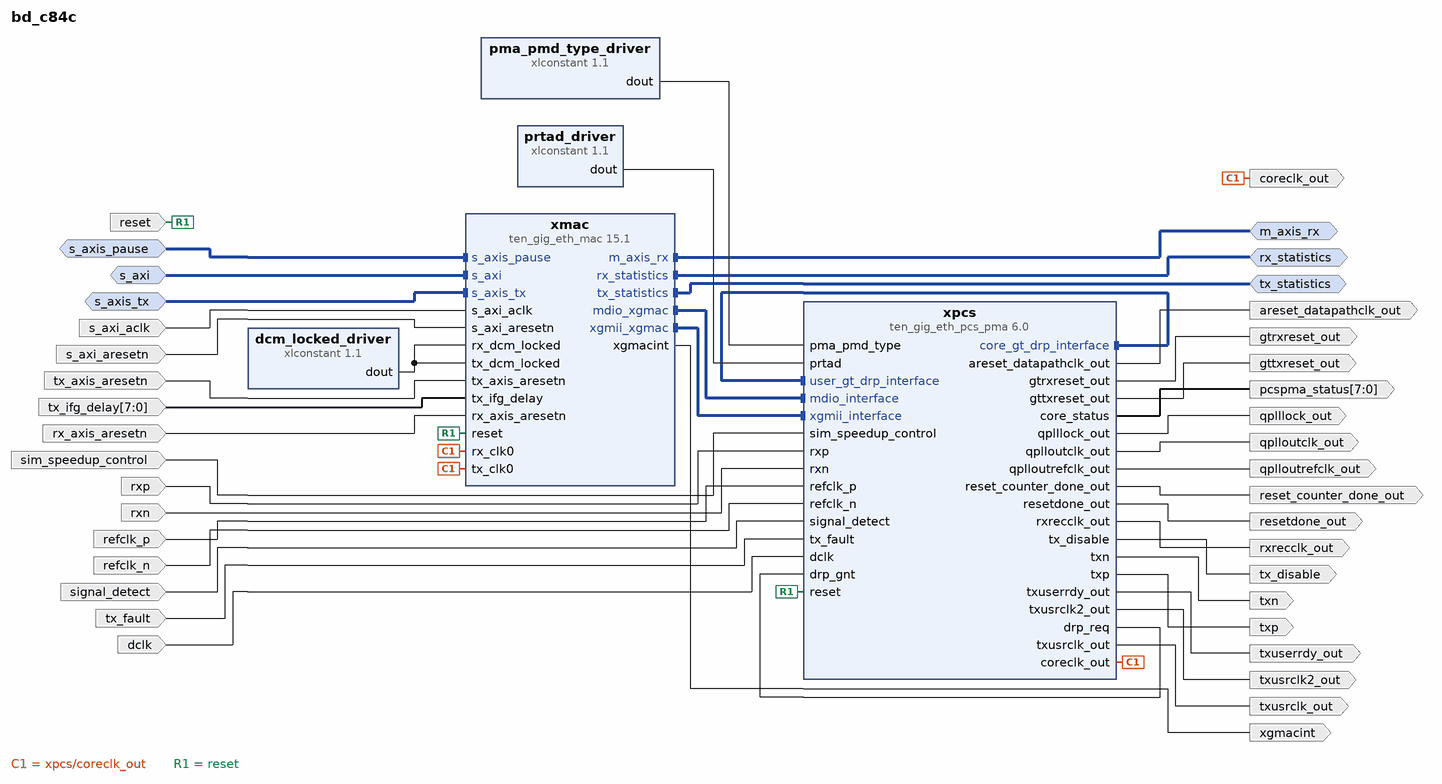
[diagram p0: block diagram of the top level]
# Vivado block design bd_c84c, xc7k325tffg676-2, Vivado 2018.3
create_bd_design bd_c84c

create_bd_intf_port -mode Slave -vlnv xilinx.com:interface:axis_rtl:1.0 s_axis_tx
set_property -dict {CONFIG.FREQ_HZ 156250000} [get_bd_intf_ports s_axis_tx]
create_bd_intf_port -mode Master -vlnv xilinx.com:interface:axis_rtl:1.0 m_axis_rx
set_property -dict {CONFIG.FREQ_HZ 156250000} [get_bd_intf_ports m_axis_rx]
create_bd_intf_port -mode Slave -vlnv xilinx.com:interface:axis_rtl:1.0 s_axis_pause
set_property -dict {CONFIG.FREQ_HZ 156250000} [get_bd_intf_ports s_axis_pause]
create_bd_intf_port -mode Master -vlnv xilinx.com:display_ten_gig_eth_mac:statistics_rtl:2.0 tx_statistics
create_bd_intf_port -mode Master -vlnv xilinx.com:display_ten_gig_eth_mac:statistics_rtl:2.0 rx_statistics
create_bd_intf_port -mode Slave -vlnv xilinx.com:interface:aximm_rtl:1.0 s_axi
set_property -dict {CONFIG.ADDR_WIDTH 16} [get_bd_intf_ports s_axi]
create_bd_port -dir I -type rst tx_axis_aresetn
create_bd_port -dir I -type rst rx_axis_aresetn
create_bd_port -dir I -from 7 -to 0 tx_ifg_delay
create_bd_port -dir I -type clk dclk
create_bd_port -dir O txp
create_bd_port -dir O txn
create_bd_port -dir I rxp
create_bd_port -dir I rxn
create_bd_port -dir I signal_detect
create_bd_port -dir I tx_fault
create_bd_port -dir O tx_disable
create_bd_port -dir O -from 7 -to 0 pcspma_status
create_bd_port -dir I sim_speedup_control
create_bd_port -dir O -type clk rxrecclk_out
set_property -dict {CONFIG.FREQ_HZ 322265625} [get_bd_ports rxrecclk_out]
create_bd_port -dir I -type clk s_axi_aclk
create_bd_port -dir I -type rst s_axi_aresetn
create_bd_port -dir O -type intr xgmacint
create_bd_port -dir O -type rst areset_datapathclk_out
create_bd_port -dir O -type clk txusrclk_out
set_property -dict {CONFIG.FREQ_HZ 322265625} [get_bd_ports txusrclk_out]
create_bd_port -dir O -type clk txusrclk2_out
set_property -dict {CONFIG.FREQ_HZ 322265625} [get_bd_ports txusrclk2_out]
create_bd_port -dir O -type rst gttxreset_out
create_bd_port -dir O -type rst gtrxreset_out
create_bd_port -dir O txuserrdy_out
create_bd_port -dir O -type clk coreclk_out
set_property -dict [list \
  CONFIG.ASSOCIATED_ASYNC_RESET tx_axis_aresetn:rx_axis_aresetn \
  CONFIG.ASSOCIATED_BUSIF m_axis_rx:s_axis_pause:s_axis_tx \
  CONFIG.FREQ_HZ 156250000 \
] [get_bd_ports coreclk_out]
create_bd_port -dir O resetdone_out
create_bd_port -dir O reset_counter_done_out
create_bd_port -dir O qplllock_out
create_bd_port -dir O -type clk qplloutclk_out
create_bd_port -dir O -type clk qplloutrefclk_out
set_property -dict {CONFIG.FREQ_HZ 156250000} [get_bd_ports qplloutrefclk_out]
create_bd_port -dir I refclk_p
set_property -dict {CONFIG.FREQ_HZ 156250000} [get_bd_ports refclk_p]
create_bd_port -dir I refclk_n
set_property -dict {CONFIG.FREQ_HZ 156250000} [get_bd_ports refclk_n]
create_bd_port -dir I -type rst reset

create_bd_cell -type ip -vlnv xilinx.com:ip:ten_gig_eth_mac:15.1 xmac
set_property -dict [list \
  CONFIG.Data_Rate 10Gbps \
  CONFIG.Enable_Priority_Flow_Control false \
  CONFIG.IEEE_1588 None \
  CONFIG.Low_Latency_32_bit_MAC 64bit \
  CONFIG.Management_Frequency 125.00 \
  CONFIG.Management_Interface true \
  CONFIG.Physical_Interface Internal \
  CONFIG.Statistics_Gathering true \
  CONFIG.Timer_Format Time_of_day \
] [get_bd_cells xmac]
create_bd_cell -type ip -vlnv xilinx.com:ip:ten_gig_eth_pcs_pma:6.0 xpcs
set_property -dict [list \
  CONFIG.DClkRate 125.00 \
  CONFIG.IEEE_1588 None \
  CONFIG.Locations X0Y0 \
  CONFIG.MDIO_Management true \
  CONFIG.RefClk clk0 \
  CONFIG.RefClkRate 156.25 \
  CONFIG.SupportLevel 1 \
  CONFIG.Timer_Format Time_of_day \
  CONFIG.TransceiverControl false \
  CONFIG.TransceiverInExample false \
  CONFIG.baser32 64bit \
] [get_bd_cells xpcs]
create_bd_cell -type ip -vlnv xilinx.com:ip:xlconstant:1.1 prtad_driver
set_property -dict {CONFIG.CONST_VAL 0 CONFIG.CONST_WIDTH 5} [get_bd_cells prtad_driver]
create_bd_cell -type ip -vlnv xilinx.com:ip:xlconstant:1.1 dcm_locked_driver
set_property -dict {CONFIG.CONST_VAL 1 CONFIG.CONST_WIDTH 1} [get_bd_cells dcm_locked_driver]
create_bd_cell -type ip -vlnv xilinx.com:ip:xlconstant:1.1 pma_pmd_type_driver
set_property -dict {CONFIG.CONST_VAL 5 CONFIG.CONST_WIDTH 3} [get_bd_cells pma_pmd_type_driver]

# ---- connections ----

connect_bd_intf_net [get_bd_intf_pins xmac/mdio_xgmac] [get_bd_intf_pins xpcs/mdio_interface]
connect_bd_intf_net [get_bd_intf_pins xpcs/core_gt_drp_interface] [get_bd_intf_pins xpcs/user_gt_drp_interface]
connect_bd_intf_net [get_bd_intf_ports s_axis_pause] [get_bd_intf_pins xmac/s_axis_pause]
connect_bd_intf_net [get_bd_intf_pins xmac/xgmii_xgmac] [get_bd_intf_pins xpcs/xgmii_interface]
connect_bd_intf_net [get_bd_intf_ports tx_statistics] [get_bd_intf_pins xmac/tx_statistics]
connect_bd_intf_net [get_bd_intf_ports m_axis_rx] [get_bd_intf_pins xmac/m_axis_rx]
connect_bd_intf_net [get_bd_intf_ports rx_statistics] [get_bd_intf_pins xmac/rx_statistics]
connect_bd_intf_net [get_bd_intf_ports s_axi] [get_bd_intf_pins xmac/s_axi]
connect_bd_intf_net [get_bd_intf_ports s_axis_tx] [get_bd_intf_pins xmac/s_axis_tx]
connect_bd_net [get_bd_ports s_axi_aclk] [get_bd_pins xmac/s_axi_aclk]
connect_bd_net [get_bd_ports s_axi_aresetn] [get_bd_pins xmac/s_axi_aresetn]
connect_bd_net [get_bd_pins xmac/xgmacint] [get_bd_ports xgmacint]
connect_bd_net [get_bd_ports tx_axis_aresetn] [get_bd_pins xmac/tx_axis_aresetn]
connect_bd_net [get_bd_ports tx_ifg_delay] [get_bd_pins xmac/tx_ifg_delay]
connect_bd_net [get_bd_ports rx_axis_aresetn] [get_bd_pins xmac/rx_axis_aresetn]
connect_bd_net [get_bd_ports sim_speedup_control] [get_bd_pins xpcs/sim_speedup_control]
connect_bd_net [get_bd_ports rxp] [get_bd_pins xpcs/rxp]
connect_bd_net [get_bd_ports rxn] [get_bd_pins xpcs/rxn]
connect_bd_net [get_bd_pins xpcs/txp] [get_bd_ports txp]
connect_bd_net [get_bd_pins xpcs/txn] [get_bd_ports txn]
connect_bd_net [get_bd_pins xpcs/tx_disable] [get_bd_ports tx_disable]
connect_bd_net [get_bd_pins xpcs/rxrecclk_out] [get_bd_ports rxrecclk_out]
connect_bd_net [get_bd_pins pma_pmd_type_driver/dout] [get_bd_pins xpcs/pma_pmd_type]
connect_bd_net [get_bd_pins xpcs/areset_datapathclk_out] [get_bd_ports areset_datapathclk_out]
connect_bd_net [get_bd_pins xpcs/coreclk_out] [get_bd_ports coreclk_out] [get_bd_pins xmac/tx_clk0] [get_bd_pins xmac/rx_clk0]
connect_bd_net [get_bd_ports reset] [get_bd_pins xpcs/reset] [get_bd_pins xmac/reset]
connect_bd_net [get_bd_ports refclk_p] [get_bd_pins xpcs/refclk_p]
connect_bd_net [get_bd_ports refclk_n] [get_bd_pins xpcs/refclk_n]
connect_bd_net [get_bd_pins xpcs/resetdone_out] [get_bd_ports resetdone_out]
connect_bd_net [get_bd_ports signal_detect] [get_bd_pins xpcs/signal_detect]
connect_bd_net [get_bd_ports tx_fault] [get_bd_pins xpcs/tx_fault]
connect_bd_net [get_bd_pins xpcs/qplllock_out] [get_bd_ports qplllock_out]
connect_bd_net [get_bd_pins xpcs/qplloutclk_out] [get_bd_ports qplloutclk_out]
connect_bd_net [get_bd_pins xpcs/qplloutrefclk_out] [get_bd_ports qplloutrefclk_out]
connect_bd_net [get_bd_pins xpcs/core_status] [get_bd_ports pcspma_status]
connect_bd_net [get_bd_pins xpcs/reset_counter_done_out] [get_bd_ports reset_counter_done_out]
connect_bd_net [get_bd_pins xpcs/txusrclk_out] [get_bd_ports txusrclk_out]
connect_bd_net [get_bd_pins xpcs/txusrclk2_out] [get_bd_ports txusrclk2_out]
connect_bd_net [get_bd_pins xpcs/gttxreset_out] [get_bd_ports gttxreset_out]
connect_bd_net [get_bd_pins xpcs/gtrxreset_out] [get_bd_ports gtrxreset_out]
connect_bd_net [get_bd_pins xpcs/txuserrdy_out] [get_bd_ports txuserrdy_out]
connect_bd_net [get_bd_pins xpcs/drp_req] [get_bd_pins xpcs/drp_gnt]
connect_bd_net [get_bd_ports dclk] [get_bd_pins xpcs/dclk]
connect_bd_net [get_bd_pins prtad_driver/dout] [get_bd_pins xpcs/prtad]
connect_bd_net [get_bd_pins dcm_locked_driver/dout] [get_bd_pins xmac/tx_dcm_locked] [get_bd_pins xmac/rx_dcm_locked]

# ---- address map ----
assign_bd_address -offset 0x0000 -range 64K -target_address_space [get_bd_addr_spaces s_axi] [get_bd_addr_segs xmac/s_axi/Reg]

validate_bd_design
save_bd_design
